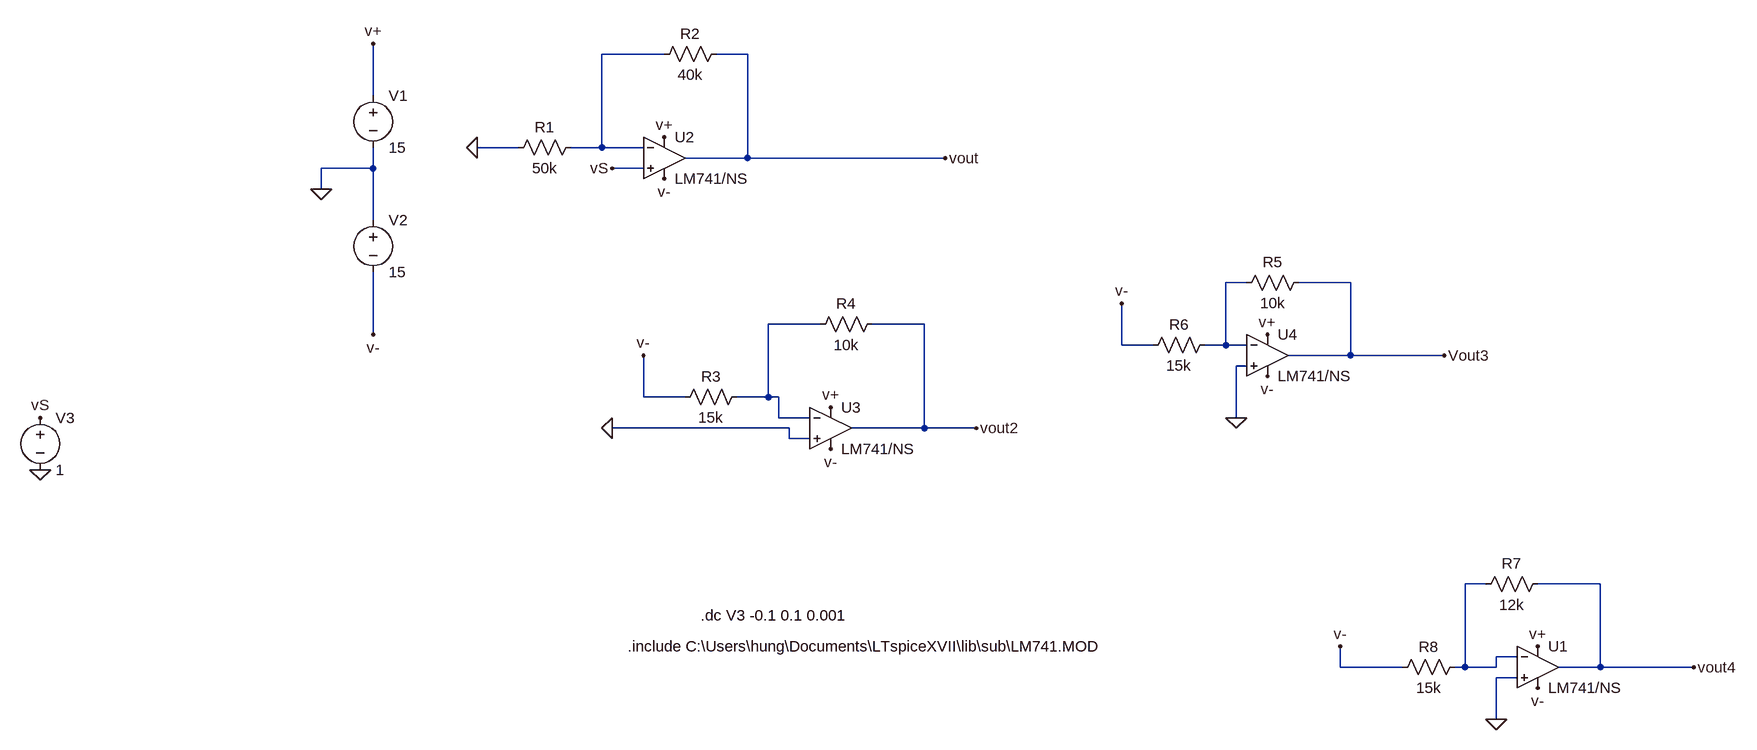
[diagram p0: schematic part 5.asc]
part 5.asc, the LTspice schematic file:
Version 4
SHEET 1 2304 1204
WIRE 256 160 160 160
WIRE 384 160 336 160
WIRE -192 224 -192 144
WIRE 32 304 -32 304
WIRE 160 304 160 160
WIRE 160 304 112 304
WIRE 224 304 160 304
WIRE 384 320 384 160
WIRE 384 320 288 320
WIRE 688 320 384 320
WIRE -192 336 -192 304
WIRE -192 336 -272 336
WIRE 224 336 176 336
WIRE -272 368 -272 336
WIRE -192 416 -192 336
WIRE 1152 512 1120 512
WIRE 1312 512 1232 512
WIRE 496 576 416 576
WIRE 656 576 576 576
WIRE -192 592 -192 496
WIRE 960 608 960 544
WIRE 1008 608 960 608
WIRE 1120 608 1120 512
WIRE 1120 608 1088 608
WIRE 1152 608 1120 608
WIRE 1312 624 1312 512
WIRE 1312 624 1216 624
WIRE 1456 624 1312 624
WIRE 1152 640 1136 640
WIRE 224 688 224 624
WIRE 288 688 224 688
WIRE 416 688 416 576
WIRE 416 688 368 688
WIRE 432 688 416 688
WIRE 432 720 432 688
WIRE 480 720 432 720
WIRE 1136 720 1136 640
WIRE 448 736 176 736
WIRE 656 736 656 576
WIRE 656 736 544 736
WIRE 736 736 656 736
WIRE 448 752 448 736
WIRE 480 752 448 752
WIRE 1520 976 1488 976
WIRE 1696 976 1600 976
WIRE 1568 1088 1536 1088
WIRE 1296 1104 1296 1072
WIRE 1392 1104 1296 1104
WIRE 1488 1104 1488 976
WIRE 1488 1104 1472 1104
WIRE 1536 1104 1536 1088
WIRE 1536 1104 1488 1104
WIRE 1696 1104 1696 976
WIRE 1696 1104 1632 1104
WIRE 1840 1104 1696 1104
WIRE 1568 1120 1536 1120
WIRE 1536 1184 1536 1120
FLAG -272 368 0
FLAG -192 144 v+
FLAG 256 288 v+
FLAG -192 592 v-
FLAG 256 352 v-
FLAG 688 320 vout
FLAG -32 304 0
FLAG 512 704 v+
FLAG 512 768 v-
FLAG 176 736 0
FLAG 224 624 v-
FLAG 736 736 vout2
FLAG -704 800 0
FLAG -704 720 vS
FLAG 176 336 vS
FLAG 1136 720 0
FLAG 1536 1184 0
FLAG 1296 1072 v-
FLAG 960 544 v-
FLAG 1456 624 Vout3
FLAG 1840 1104 vout4
FLAG 1184 656 v-
FLAG 1600 1136 v-
FLAG 1600 1072 v+
FLAG 1184 592 v+
SYMBOL Opamps\\opamp2 256 256 R0
SYMATTR InstName U2
SYMATTR Value LM741/NS
SYMBOL voltage -192 208 R0
WINDOW 123 0 0 Left 0
WINDOW 39 0 0 Left 0
SYMATTR InstName V1
SYMATTR Value 15
SYMBOL voltage -192 400 R0
WINDOW 123 0 0 Left 0
WINDOW 39 0 0 Left 0
SYMATTR InstName V2
SYMATTR Value 15
SYMBOL res 128 288 R90
WINDOW 0 0 56 VBottom 2
WINDOW 3 32 56 VTop 2
SYMATTR InstName R1
SYMATTR Value 50k
SYMBOL res 352 144 R90
WINDOW 0 0 56 VBottom 2
WINDOW 3 32 56 VTop 2
SYMATTR InstName R2
SYMATTR Value 40k
SYMBOL Opamps\\opamp2 512 672 R0
SYMATTR InstName U3
SYMATTR Value LM741/NS
SYMBOL res 384 672 R90
WINDOW 0 0 56 VBottom 2
WINDOW 3 32 56 VTop 2
SYMATTR InstName R3
SYMATTR Value 15k
SYMBOL res 592 560 R90
WINDOW 0 0 56 VBottom 2
WINDOW 3 32 56 VTop 2
SYMATTR InstName R4
SYMATTR Value 10k
SYMBOL voltage -704 704 R0
WINDOW 123 0 0 Left 0
WINDOW 39 0 0 Left 0
SYMATTR InstName V3
SYMATTR Value 1
SYMBOL res 1248 496 R90
WINDOW 0 0 56 VBottom 2
WINDOW 3 32 56 VTop 2
SYMATTR InstName R5
SYMATTR Value 10k
SYMBOL res 1104 592 R90
WINDOW 0 0 56 VBottom 2
WINDOW 3 32 56 VTop 2
SYMATTR InstName R6
SYMATTR Value 15k
SYMBOL res 1616 960 R90
WINDOW 0 0 56 VBottom 2
WINDOW 3 32 56 VTop 2
SYMATTR InstName R7
SYMATTR Value 12k
SYMBOL res 1488 1088 R90
WINDOW 0 0 56 VBottom 2
WINDOW 3 32 56 VTop 2
SYMATTR InstName R8
SYMATTR Value 15k
SYMBOL Opamps\\opamp2 1600 1040 R0
SYMATTR InstName U1
SYMATTR Value LM741/NS
SYMBOL Opamps\\opamp2 1184 560 R0
SYMATTR InstName U4
SYMATTR Value LM741/NS
TEXT 200 1072 Left 2 !.include C:\\Users\\hung\\Documents\\LTspiceXVII\\lib\\sub\\LM741.MOD
TEXT 312 1024 Left 2 !.dc V3 -0.1 0.1 0.001

The netlist it stands for:
* part 5.asc
XU2 vS N001 v+ v- vout LM741/NS  ; pins In+ In- V+ V- OUT
V1 v+ 0 15
V2 0 v- 15
R1 N001 0 50k
R2 vout N001 40k
XU3 0 N003 v+ v- vout2 LM741/NS  ; pins In+ In- V+ V- OUT
R3 N003 v- 15k
R4 vout2 N003 10k
V3 vS 0 1
R5 Vout3 N002 10k
R6 N002 v- 15k
R7 vout4 N004 12k
R8 N004 v- 15k
XU1 0 N004 v+ v- vout4 LM741/NS  ; pins In+ In- V+ V- OUT
XU4 0 N002 v+ v- Vout3 LM741/NS  ; pins In+ In- V+ V- OUT
.include C:\Users\hung\Documents\LTspiceXVII\lib\sub\LM741.MOD
.dc V3 -0.1 0.1 0.001
.backanno
.end